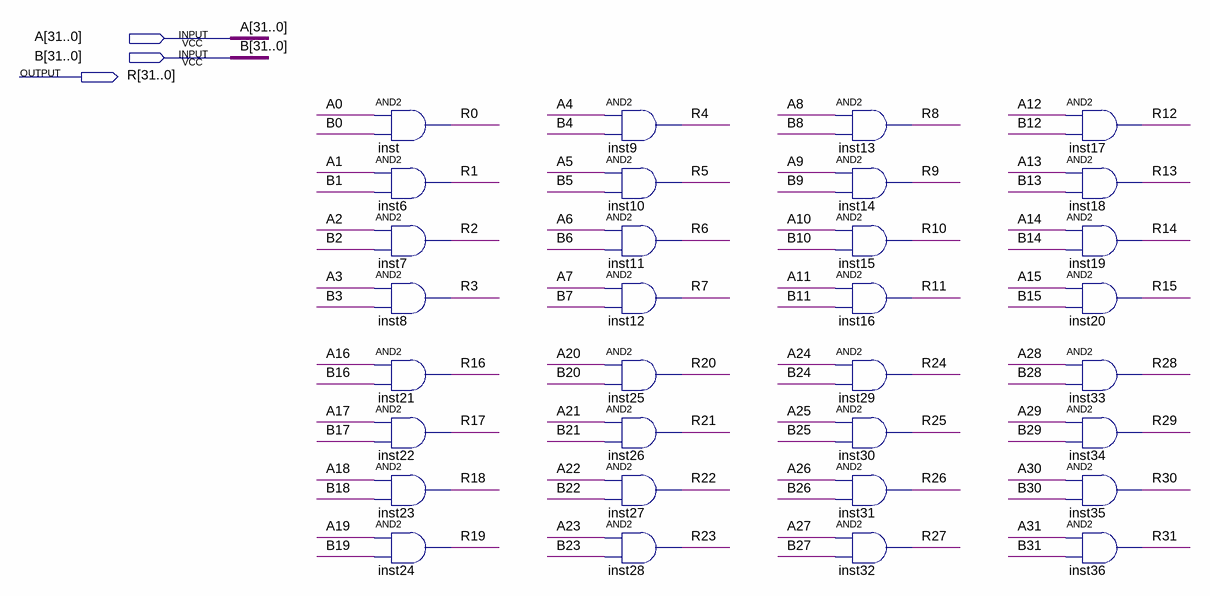
[diagram p0: schematic sheet]
// Quartus schematic and_32_bit.bdf as structural Verilog: 32 symbols, 3 pins
module and_32_bit (
  input  [31:0] A,
  input  [31:0] B,
  output [31:0] R
);

  and inst (R[0], A[0], B[0]);
  and inst6 (R[1], A[1], B[1]);
  and inst7 (R[2], A[2], B[2]);
  and inst8 (R[3], A[3], B[3]);
  and inst21 (R[16], A[16], B[16]);
  and inst22 (R[17], A[17], B[17]);
  and inst23 (R[18], A[18], B[18]);
  and inst24 (R[19], A[19], B[19]);
  and inst9 (R[4], A[4], B[4]);
  and inst10 (R[5], A[5], B[5]);
  and inst11 (R[6], A[6], B[6]);
  and inst12 (R[7], A[7], B[7]);
  and inst25 (R[20], A[20], B[20]);
  and inst26 (R[21], A[21], B[21]);
  and inst27 (R[22], A[22], B[22]);
  and inst28 (R[23], A[23], B[23]);
  and inst13 (R[8], A[8], B[8]);
  and inst14 (R[9], A[9], B[9]);
  and inst15 (R[10], A[10], B[10]);
  and inst16 (R[11], A[11], B[11]);
  and inst29 (R[24], A[24], B[24]);
  and inst30 (R[25], A[25], B[25]);
  and inst31 (R[26], A[26], B[26]);
  and inst32 (R[27], A[27], B[27]);
  and inst17 (R[12], A[12], B[12]);
  and inst18 (R[13], A[13], B[13]);
  and inst19 (R[14], A[14], B[14]);
  and inst20 (R[15], A[15], B[15]);
  and inst33 (R[28], A[28], B[28]);
  and inst34 (R[29], A[29], B[29]);
  and inst35 (R[30], A[30], B[30]);
  and inst36 (R[31], A[31], B[31]);
endmodule
